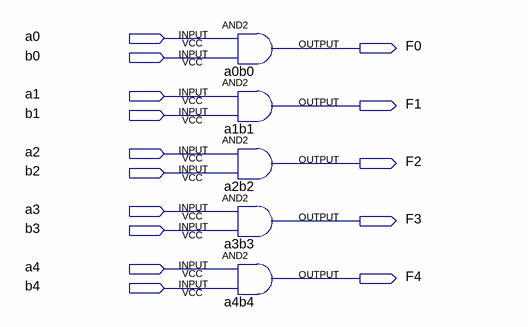
[diagram p0: schematic sheet]
// Quartus schematic A AND B.bdf as structural Verilog: 5 symbols, 15 pins
module \A_AND_B  (
  input  a0,
  input  b0,
  input  a1,
  input  b1,
  input  a2,
  input  b2,
  input  a3,
  input  b3,
  input  a4,
  input  b4,
  output F0,
  output F1,
  output F2,
  output F3,
  output F4
);

  and a0b0 (F0, a0, b0);
  and a1b1 (F1, a1, b1);
  and a2b2 (F2, a2, b2);
  and a3b3 (F3, a3, b3);
  and a4b4 (F4, a4, b4);
endmodule
